# Altium schematic sheet 09_servo.SchDoc: =Proj_Title
size B; Address1: Giesshuebelstrasse 40; Address2: 8045 Zurich, Switzerland; SheetNumber: 9
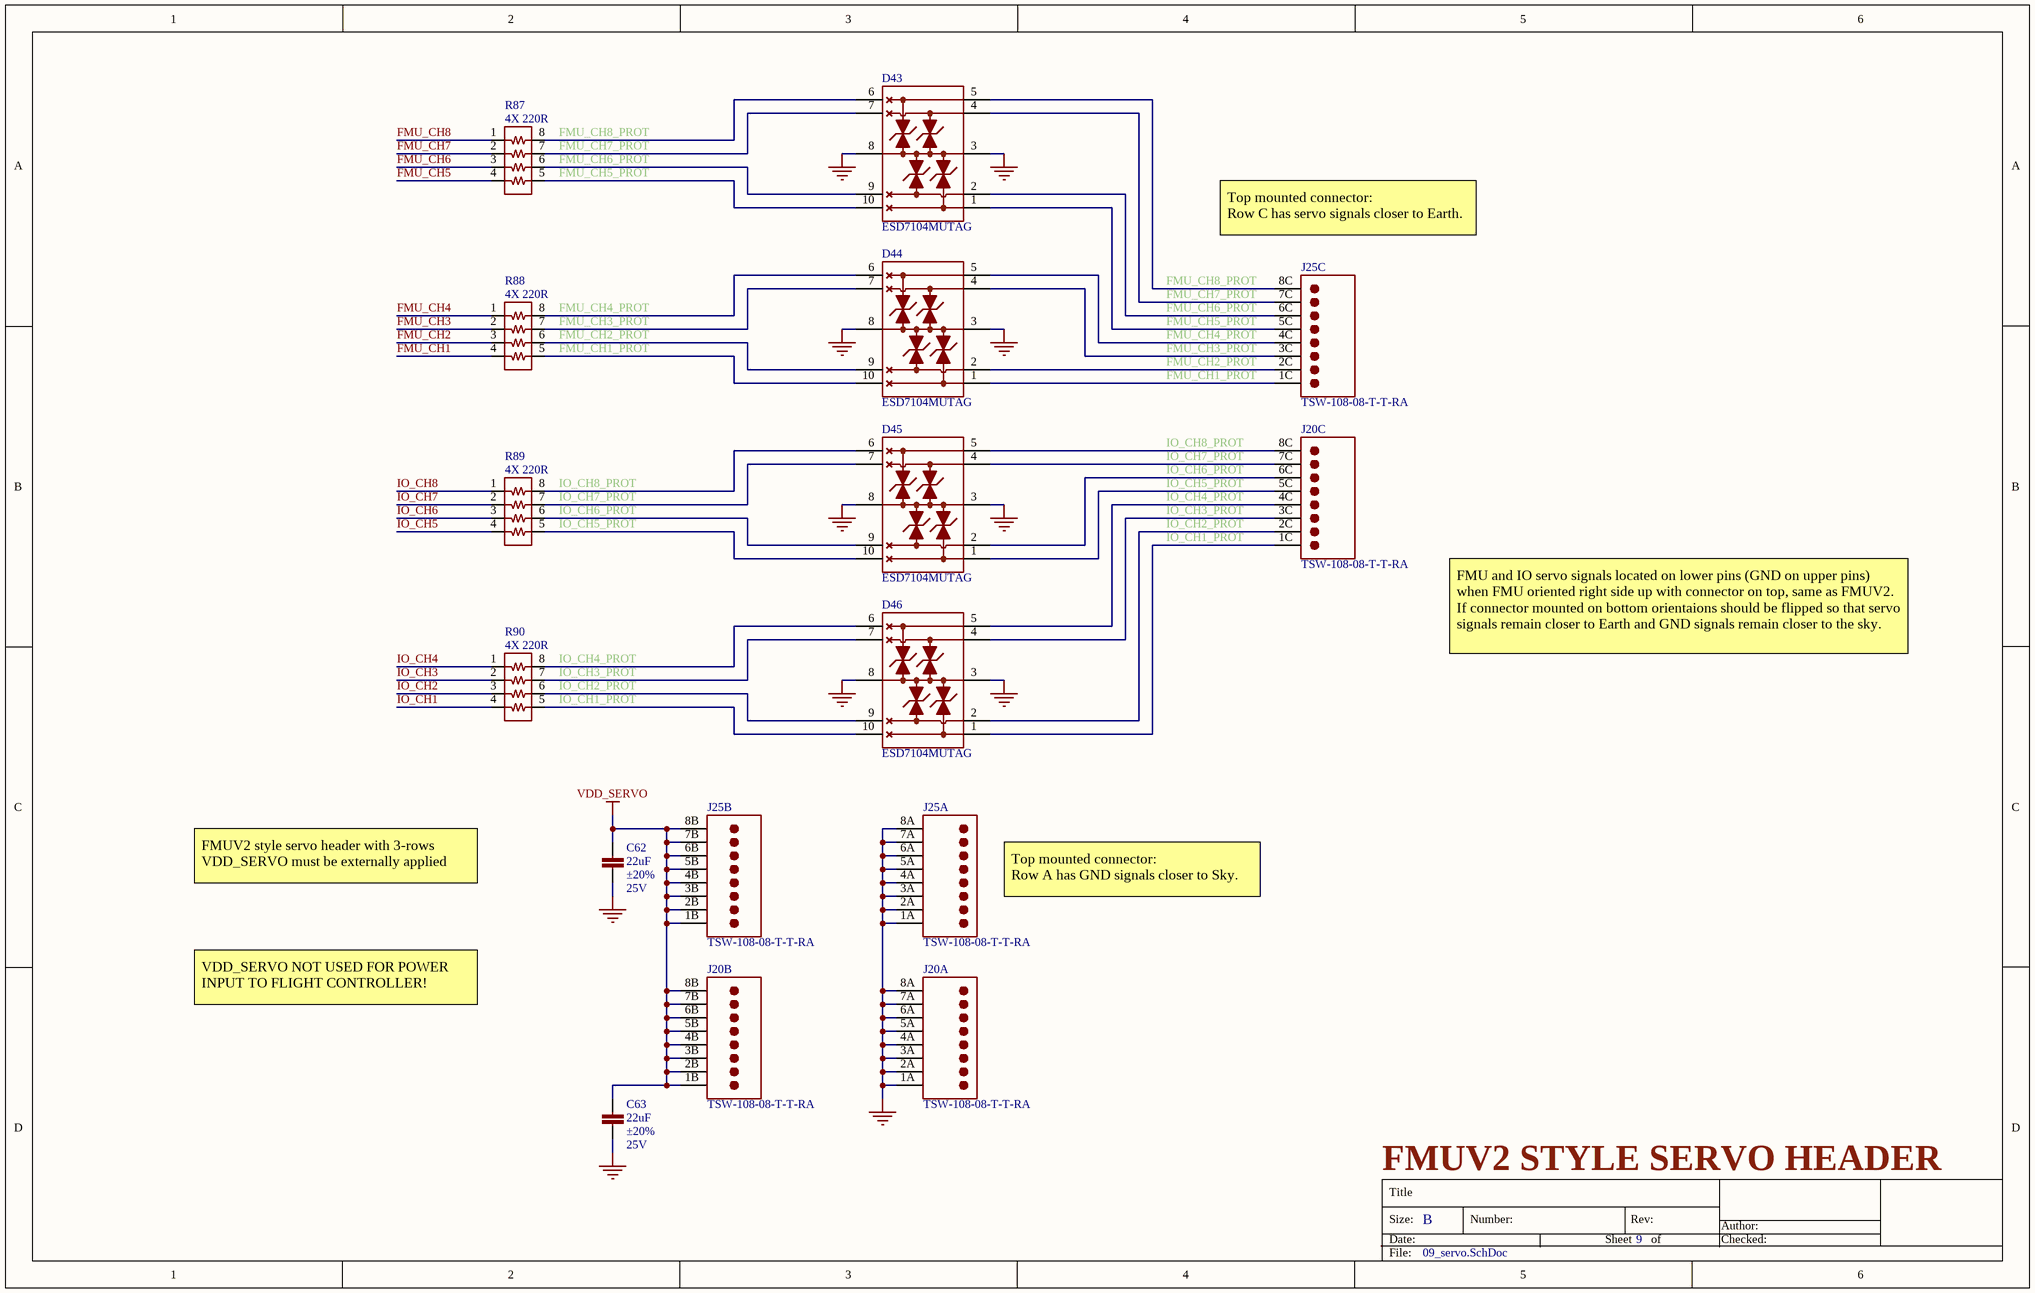
[diagram p0: 09_servo.SchDoc]

## Parts
C62  value 22uF  Tolerance: ±20%  Voltage - Rated: 25V  [CAPC200X125X70L40N]  (hidden comment: CAP CER 22UF 20% 25V X5R 0805)
C63  value 22uF  Tolerance: ±20%  Voltage - Rated: 25V  [CAPC200X125X70L40N]  (hidden comment: CAP CER 22UF 20% 25V X5R 0805)
D43  Manufacturer Part Number: ESD7104MUTAG  [UDFN10P50_250X100X55L35X20N]  (hidden comment: DIODE TVS BIDIRECTIONAL 5V 10V 10UDFN)
D44  Manufacturer Part Number: ESD7104MUTAG  [UDFN10P50_250X100X55L35X20N]  (hidden comment: DIODE TVS BIDIRECTIONAL 5V 10V 10UDFN)
D45  Manufacturer Part Number: ESD7104MUTAG  [UDFN10P50_250X100X55L35X20N]  (hidden comment: DIODE TVS BIDIRECTIONAL 5V 10V 10UDFN)
D46  Manufacturer Part Number: ESD7104MUTAG  [UDFN10P50_250X100X55L35X20N]  (hidden comment: DIODE TVS BIDIRECTIONAL 5V 10V 10UDFN)
J20  Manufacturer Part Number: TSW-108-08-T-T-RA  [3X8RA_ABC]  (hidden comment: CONN HDR 24POS 2.54MM RA TH)  (parts A,B,C of 3)
J25  Manufacturer Part Number: TSW-108-08-T-T-RA  [3X8RA_ABC]  (hidden comment: CONN HDR 24POS 2.54MM RA TH)  (parts A,B,C of 3)
R87  value 4X 220R  [RESCAF8P80_320X160X61L30X65N]  (hidden comment: RES ARRAY 4 RES 220 OHM 1206)
R88  value 4X 220R  [RESCAF8P80_320X160X61L30X65N]  (hidden comment: RES ARRAY 4 RES 220 OHM 1206)
R89  value 4X 220R  [RESCAF8P80_320X160X61L30X65N]  (hidden comment: RES ARRAY 4 RES 220 OHM 1206)
R90  value 4X 220R  [RESCAF8P80_320X160X61L30X65N]  (hidden comment: RES ARRAY 4 RES 220 OHM 1206)

## Nets
GND: C62.2 C63.2 D43.3(GND) D43.8(GND) D44.3(GND) D44.8(GND) D45.3(GND) D45.8(GND) D46.3(GND) D46.8(GND) J20.1A J20.2A J20.3A J20.4A J20.5A J20.6A J20.7A J20.8A J25.1A J25.2A J25.3A J25.4A J25.5A J25.6A J25.7A J25.8A
VDD_SERVO: C62.1 C63.1 J20.1B J20.2B J20.3B J20.4B J20.5B J20.6B J20.7B J20.8B J25.1B J25.2B J25.3B J25.4B J25.5B J25.6B J25.7B J25.8B
FMU_CH1: R88.4
FMU_CH1_PROT: D44.1 D44.10(NC) J25.1C R88.5
FMU_CH2: R88.3
FMU_CH2_PROT: D44.2 D44.9(NC) J25.2C R88.6
FMU_CH3: R88.2
FMU_CH3_PROT: D44.4 D44.7(NC) J25.3C R88.7
FMU_CH4: R88.1
FMU_CH4_PROT: D44.5 D44.6(NC) J25.4C R88.8
FMU_CH5: R87.4
FMU_CH5_PROT: D43.1 D43.10(NC) J25.5C R87.5
FMU_CH6: R87.3
FMU_CH6_PROT: D43.2 D43.9(NC) J25.6C R87.6
FMU_CH7: R87.2
FMU_CH7_PROT: D43.4 D43.7(NC) J25.7C R87.7
FMU_CH8: R87.1
FMU_CH8_PROT: D43.5 D43.6(NC) J25.8C R87.8
IO_CH1: R90.4
IO_CH1_PROT: D46.1 D46.10(NC) J20.1C R90.5
IO_CH2: R90.3
IO_CH2_PROT: D46.2 D46.9(NC) J20.2C R90.6
IO_CH3: R90.2
IO_CH3_PROT: D46.4 D46.7(NC) J20.3C R90.7
IO_CH4: R90.1
IO_CH4_PROT: D46.5 D46.6(NC) J20.4C R90.8
IO_CH5: R89.4
IO_CH5_PROT: D45.1 D45.10(NC) J20.5C R89.5
IO_CH6: R89.3
IO_CH6_PROT: D45.2 D45.9(NC) J20.6C R89.6
IO_CH7: R89.2
IO_CH7_PROT: D45.4 D45.7(NC) J20.7C R89.7
IO_CH8: R89.1
IO_CH8_PROT: D45.5 D45.6(NC) J20.8C R89.8

## Notes on the sheet
- Top mounted connector:
  Row C has servo signals closer to Earth.
- FMU and IO servo signals located on lower pins (GND on upper pins) when FMU oriented right side up with connector on top, same as FMUV2. If connector mounted on bottom orientaions should be flipped so that servo signals remain closer to Earth and GND signals remain closer to the sky.
- FMUV2 style servo header with 3-rows
  VDD_SERVO must be externally applied
- Top mounted connector:
  Row A has GND signals closer to Sky.
- VDD_SERVO NOT USED FOR POWER INPUT TO FLIGHT CONTROLLER!
- FMUV2 STYLE SERVO HEADER
- Title
- Size:
- Date:
- B
- Number:
- Sheet
- Rev:
- of
- Author:
- Checked:
- File:

## Library data of the parts
C62 C63 = CAP_22UF_20%_25V_X5R_0805: Manufacturer: Murata Electronics; Manufacturer Part Number: GRT21BR61E226ME13L; Packaging: Cut Tape (CT); Part Status: Active; Operating Temperature: -55°C ~ 125°C; Supplier 1: Digi-Key; Supplier Part Number 1: 490-12389-1-ND; Category: Capacitors; Stock 1: 0; Pricing 1: 1=0.58 (USD); ComponentLink1Description: https://www.digikey.com/en/products/detail/murata-electronics/GRT21BR61E226ME13L/5416811; ComponentLink1URL: https://www.digikey.com/en/products/detail/murata-electronics/GRT21BR61E226ME13L/5416811
D43-D46 = DIODE_TVS_4X_10UDFN: Manufacturer: ON Semiconductor; Packaging: Cut Tape (CT); Part Status: Active; Operating Temperature: -55°C ~ 125°C (TJ); Supplier 1: Digi-Key; Supplier Part Number 1: ESD7104MUTAGOSCT-ND; Category: Circuit Protection; Stock 1: 5750; Pricing 1: 1=0.63, 10=0.541, 100=0.40370, 500=0.31716, 1000=0.24508 (USD); ComponentLink1Description: https://www.digikey.com/product-detail/en/on-semiconductor/ESD7104MUTAG/ESD7104MUTAGOSCT-ND/3487538; ComponentLink1URL: https://www.digikey.com/product-detail/en/on-semiconductor/ESD7104MUTAG/ESD7104MUTAGOSCT-ND/3487538
J20 J25 = CONN_HDR_3X8RA_TH: Manufacturer: Samtec; System: Connector; Category: Connectors, Interconnects; Operating Temperature: -55°C ~ 125°C; Packaging: Bulk; Voltage - Rated: -; Part Status: Active; Supplier Part Number 1: TSW-108-08-T-T-RA-ND; Supplier 1: Digi-Key; Stock 1: 302; Pricing 1: 1=1.53 (USD); ComponentLink1Description: https://www.digikey.com/product-detail/en/samtec-inc/TSW-108-08-T-T-RA/TSW-108-08-T-T-RA-ND/7869165; ComponentLink1URL: https://www.digikey.com/product-detail/en/samtec-inc/TSW-108-08-T-T-RA/TSW-108-08-T-T-RA-ND/7869165
R87-R90 = RES_ARRAY_220_5%_1/16W_1206: Manufacturer: Yageo; Manufacturer Part Number: YC164-JR-07220RL; Tolerance: ±5%; Power: 1/16W; Packaging: Cut Tape (CT); Part Status: Active; Operating Temperature: -55°C ~ 155°C; Supplier 1: Digi-Key; Supplier Part Number 1: YC164J-220CT-ND; Category: Resistors; Stock 1: 17927; Pricing 1: 1=0.1, 10=0.014, 100=0.0056, 1000=0.00253, 2500=0.0022, 5000=0.00181 (USD); ComponentLink1Description: https://www.digikey.com/products/en/resistors/resistor-networks-arrays/50?k=&pkeyword=&pv16=9574&sf=0&FV=fffc000d%2C1c0002%2C1f140000%2C24280001%2Cffe00032%2C40136&quantity=&ColumnSort=0&page=1&pageSize=25; ComponentLink1URL: https://www.digikey.com/products/en/resistors/resistor-networks-arrays/50?k=&pkeyword=&pv16=9574&sf=0&FV=fffc000d%2C1c0002%2C1f140000%2C24280001%2Cffe00032%2C40136&quantity=&ColumnSort=0&page=1&pageSize=25